# Altium schematic sheet EMMC-SDMMC-PCIe-ADC.SchDoc
size A3; SheetNumber: 8; SheetTotal: 9
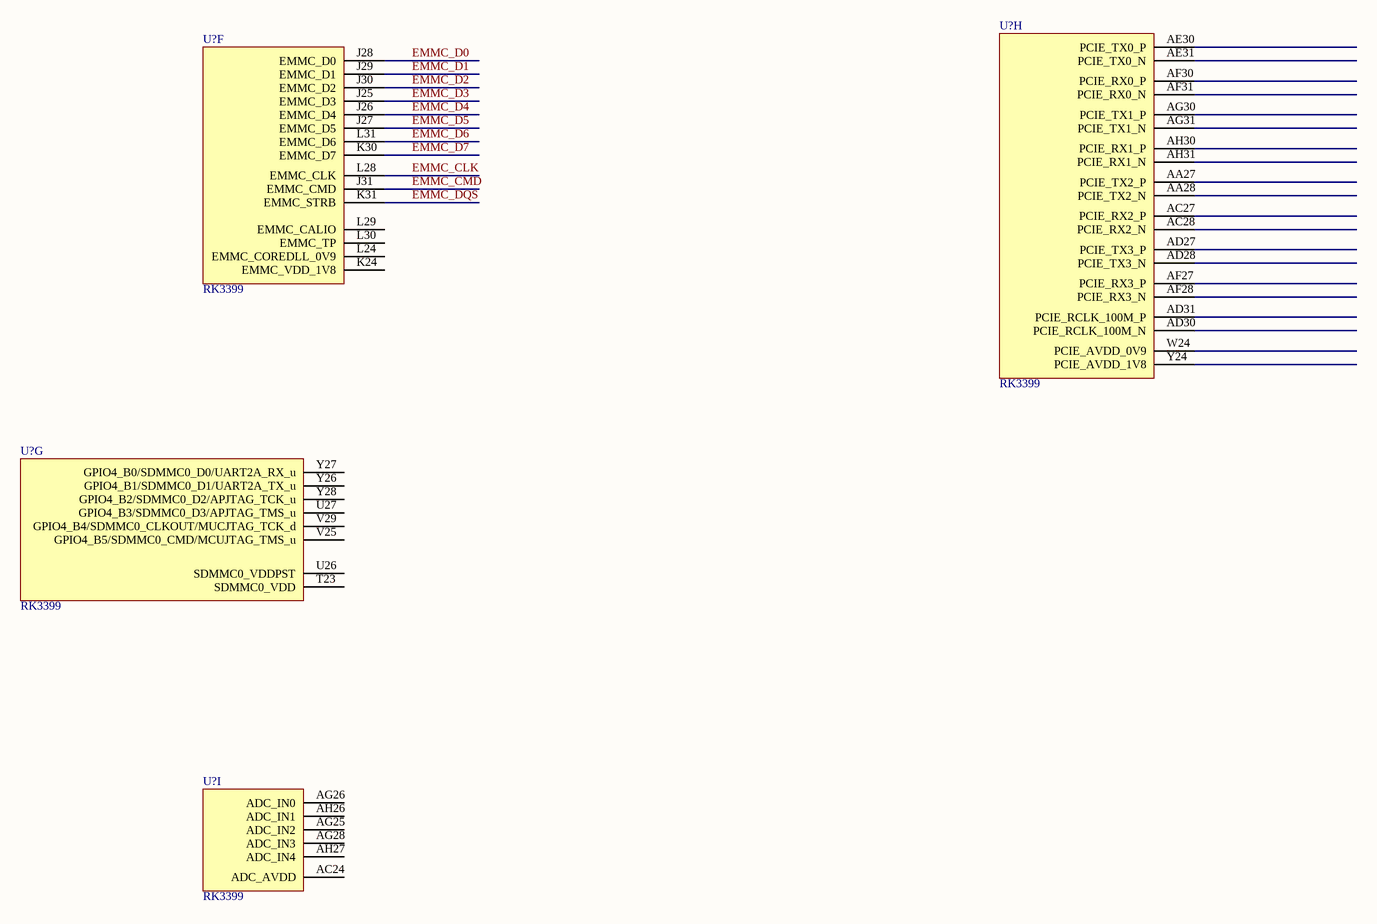
[diagram p0: EMMC-SDMMC-PCIe-ADC.SchDoc]

## Parts
(Parts that share a designator on the sheet are numbered #1, #2 ... from top to bottom, then left to right.)
U?#1  RK3399  [BGA828_RK3399]  (part H of 24)
U?#2  RK3399  [BGA828_RK3399]  (part F of 24)
U?#3  RK3399  [BGA828_RK3399]  (part G of 24)
U?#4  RK3399  [BGA828_RK3399]  (part I of 24)

## Nets
EMMC_CLK: U?#2.L28(EMMC_CLK)
EMMC_CMD: U?#2.J31(EMMC_CMD)
EMMC_D0: U?#2.J28(EMMC_D0)
EMMC_D1: U?#2.J29(EMMC_D1)
EMMC_D2: U?#2.J30(EMMC_D2)
EMMC_D3: U?#2.J25(EMMC_D3)
EMMC_D4: U?#2.J26(EMMC_D4)
EMMC_D5: U?#2.J27(EMMC_D5)
EMMC_D6: U?#2.L31(EMMC_D6)
EMMC_D7: U?#2.K30(EMMC_D7)
EMMC_DQS: U?#2.K31(EMMC_STRB)

Not connected (* = marked no-connect by the designer): U?#1 AA27(PCIE_TX2_P) AA28(PCIE_TX2_N) AC27(PCIE_RX2_P) AC28(PCIE_RX2_N) AD27(PCIE_TX3_P) AD28(PCIE_TX3_N) AD30(PCIE_RCLK_100M_N) AD31(PCIE_RCLK_100M_P) AE30(PCIE_TX0_P) AE31(PCIE_TX0_N) AF27(PCIE_RX3_P) AF28(PCIE_RX3_N) AF30(PCIE_RX0_P) AF31(PCIE_RX0_N) AG30(PCIE_TX1_P) AG31(PCIE_TX1_N) AH30(PCIE_RX1_P) AH31(PCIE_RX1_N) W24(PCIE_AVDD_0V9) Y24(PCIE_AVDD_1V8); U?#2 K24(EMMC_VDD_1V8) L24(EMMC_COREDLL_0V9) L29(EMMC_CALIO) L30(EMMC_TP); U?#3 T23(SDMMC0_VDD) U26(SDMMC0_VDDPST) U27(GPIO4_B3/SDMMC0_D3/APJTAG_TMS_u) V25(GPIO4_B5/SDMMC0_CMD/MCUJTAG_TMS_u) V29(GPIO4_B4/SDMMC0_CLKOUT/MUCJTAG_TCK_d) Y26(GPIO4_B1/SDMMC0_D1/UART2A_TX_u) Y27(GPIO4_B0/SDMMC0_D0/UART2A_RX_u) Y28(GPIO4_B2/SDMMC0_D2/APJTAG_TCK_u); U?#4 AC24(ADC_AVDD) AG25(ADC_IN2) AG26(ADC_IN0) AG28(ADC_IN3) AH26(ADC_IN1) AH27(ADC_IN4)

## Library data of the parts
U?#1-U?#4 = IC_RK3399-FCBGA828: RK3399 is a low power, high performance processor for computing, personal mobile.; Manufacturer: Rockchip; Manufacturer Part Number: RK3399; Case/Package: FCBGA828; Supplier-1: Rockchip